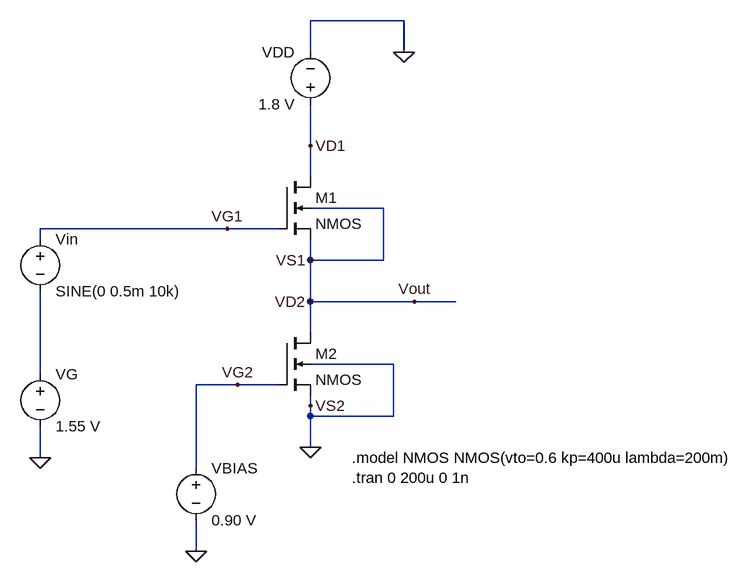
[diagram p0: schematic Draft8.asc]
Draft8.asc, the LTspice schematic file:
Version 4
SHEET 1 1064 960
WIRE 560 128 416 128
WIRE 416 176 416 128
WIRE 560 176 560 128
WIRE 416 320 416 256
WIRE 416 368 416 320
WIRE 528 416 416 416
WIRE 288 448 0 448
WIRE 368 448 288 448
WIRE 0 464 0 448
WIRE 416 496 416 464
WIRE 528 496 528 416
WIRE 528 496 416 496
WIRE 416 560 416 496
WIRE 576 560 416 560
WIRE 640 560 576 560
WIRE 416 608 416 560
WIRE 544 656 416 656
WIRE 0 672 0 544
WIRE 304 688 240 688
WIRE 368 688 304 688
WIRE 416 720 416 704
WIRE 416 736 416 720
WIRE 544 736 544 656
WIRE 544 736 416 736
WIRE 416 784 416 736
WIRE 0 800 0 752
WIRE 240 816 240 688
WIRE 240 944 240 896
FLAG 416 784 0
FLAG 240 944 0
FLAG 0 800 0
FLAG 560 176 0
FLAG 416 320 VD1
FLAG 416 496 VS1
FLAG 416 560 VD2
FLAG 288 448 VG1
FLAG 416 720 VS2
FLAG 304 688 VG2
FLAG 576 560 Vout
SYMBOL voltage 416 272 R180
WINDOW 0 24 96 Left 2
WINDOW 3 24 16 Left 2
SYMATTR InstName VDD
SYMATTR Value 1.8 V
SYMBOL nmos4 368 368 R0
SYMATTR InstName M1
SYMATTR Value2 l=0.18u w=3.33u
SYMBOL nmos4 368 608 R0
SYMATTR InstName M2
SYMATTR Value2 l=0.18u w=0.862u
SYMBOL Voltage 0 448 R0
SYMATTR InstName Vin
SYMATTR Value SINE(0 0.5m 10k)
SYMBOL Voltage 0 656 R0
SYMATTR InstName VG
SYMATTR Value 1.55 V
SYMBOL Voltage 240 800 R0
SYMATTR InstName VBIAS
SYMATTR Value 0.90 V
TEXT 480 800 Left 2 !.model NMOS NMOS(vto=0.6 kp=400u lambda=200m)\n.tran 0 200u 0 1n

The netlist it stands for:
* Draft8.asc
VDD VD1 0 1.8 V
M1 VD1 VG1 Vout Vout NMOS l=0.18u w=3.33u
M2 Vout VG2 0 0 NMOS l=0.18u w=0.862u
Vin VG1 N001 SINE(0 0.5m 10k)
VG N001 0 1.55 V
VBIAS VG2 0 0.90 V
.model NMOS NMOS
.model PMOS PMOS
.lib standard.mos
.model NMOS NMOS(vto=0.6 kp=400u lambda=200m)
.tran 0 200u 0 1n
.backanno
.end